# EasyEDA schematic SCH_hack-and-roll_2024-03-14.json
TITLE: Hack & Roll!; REV: 1.0; Date: 2024-02-08; Sheet: 1/1; Drawn By: Prophet Orpheus; Company: Orph inc.
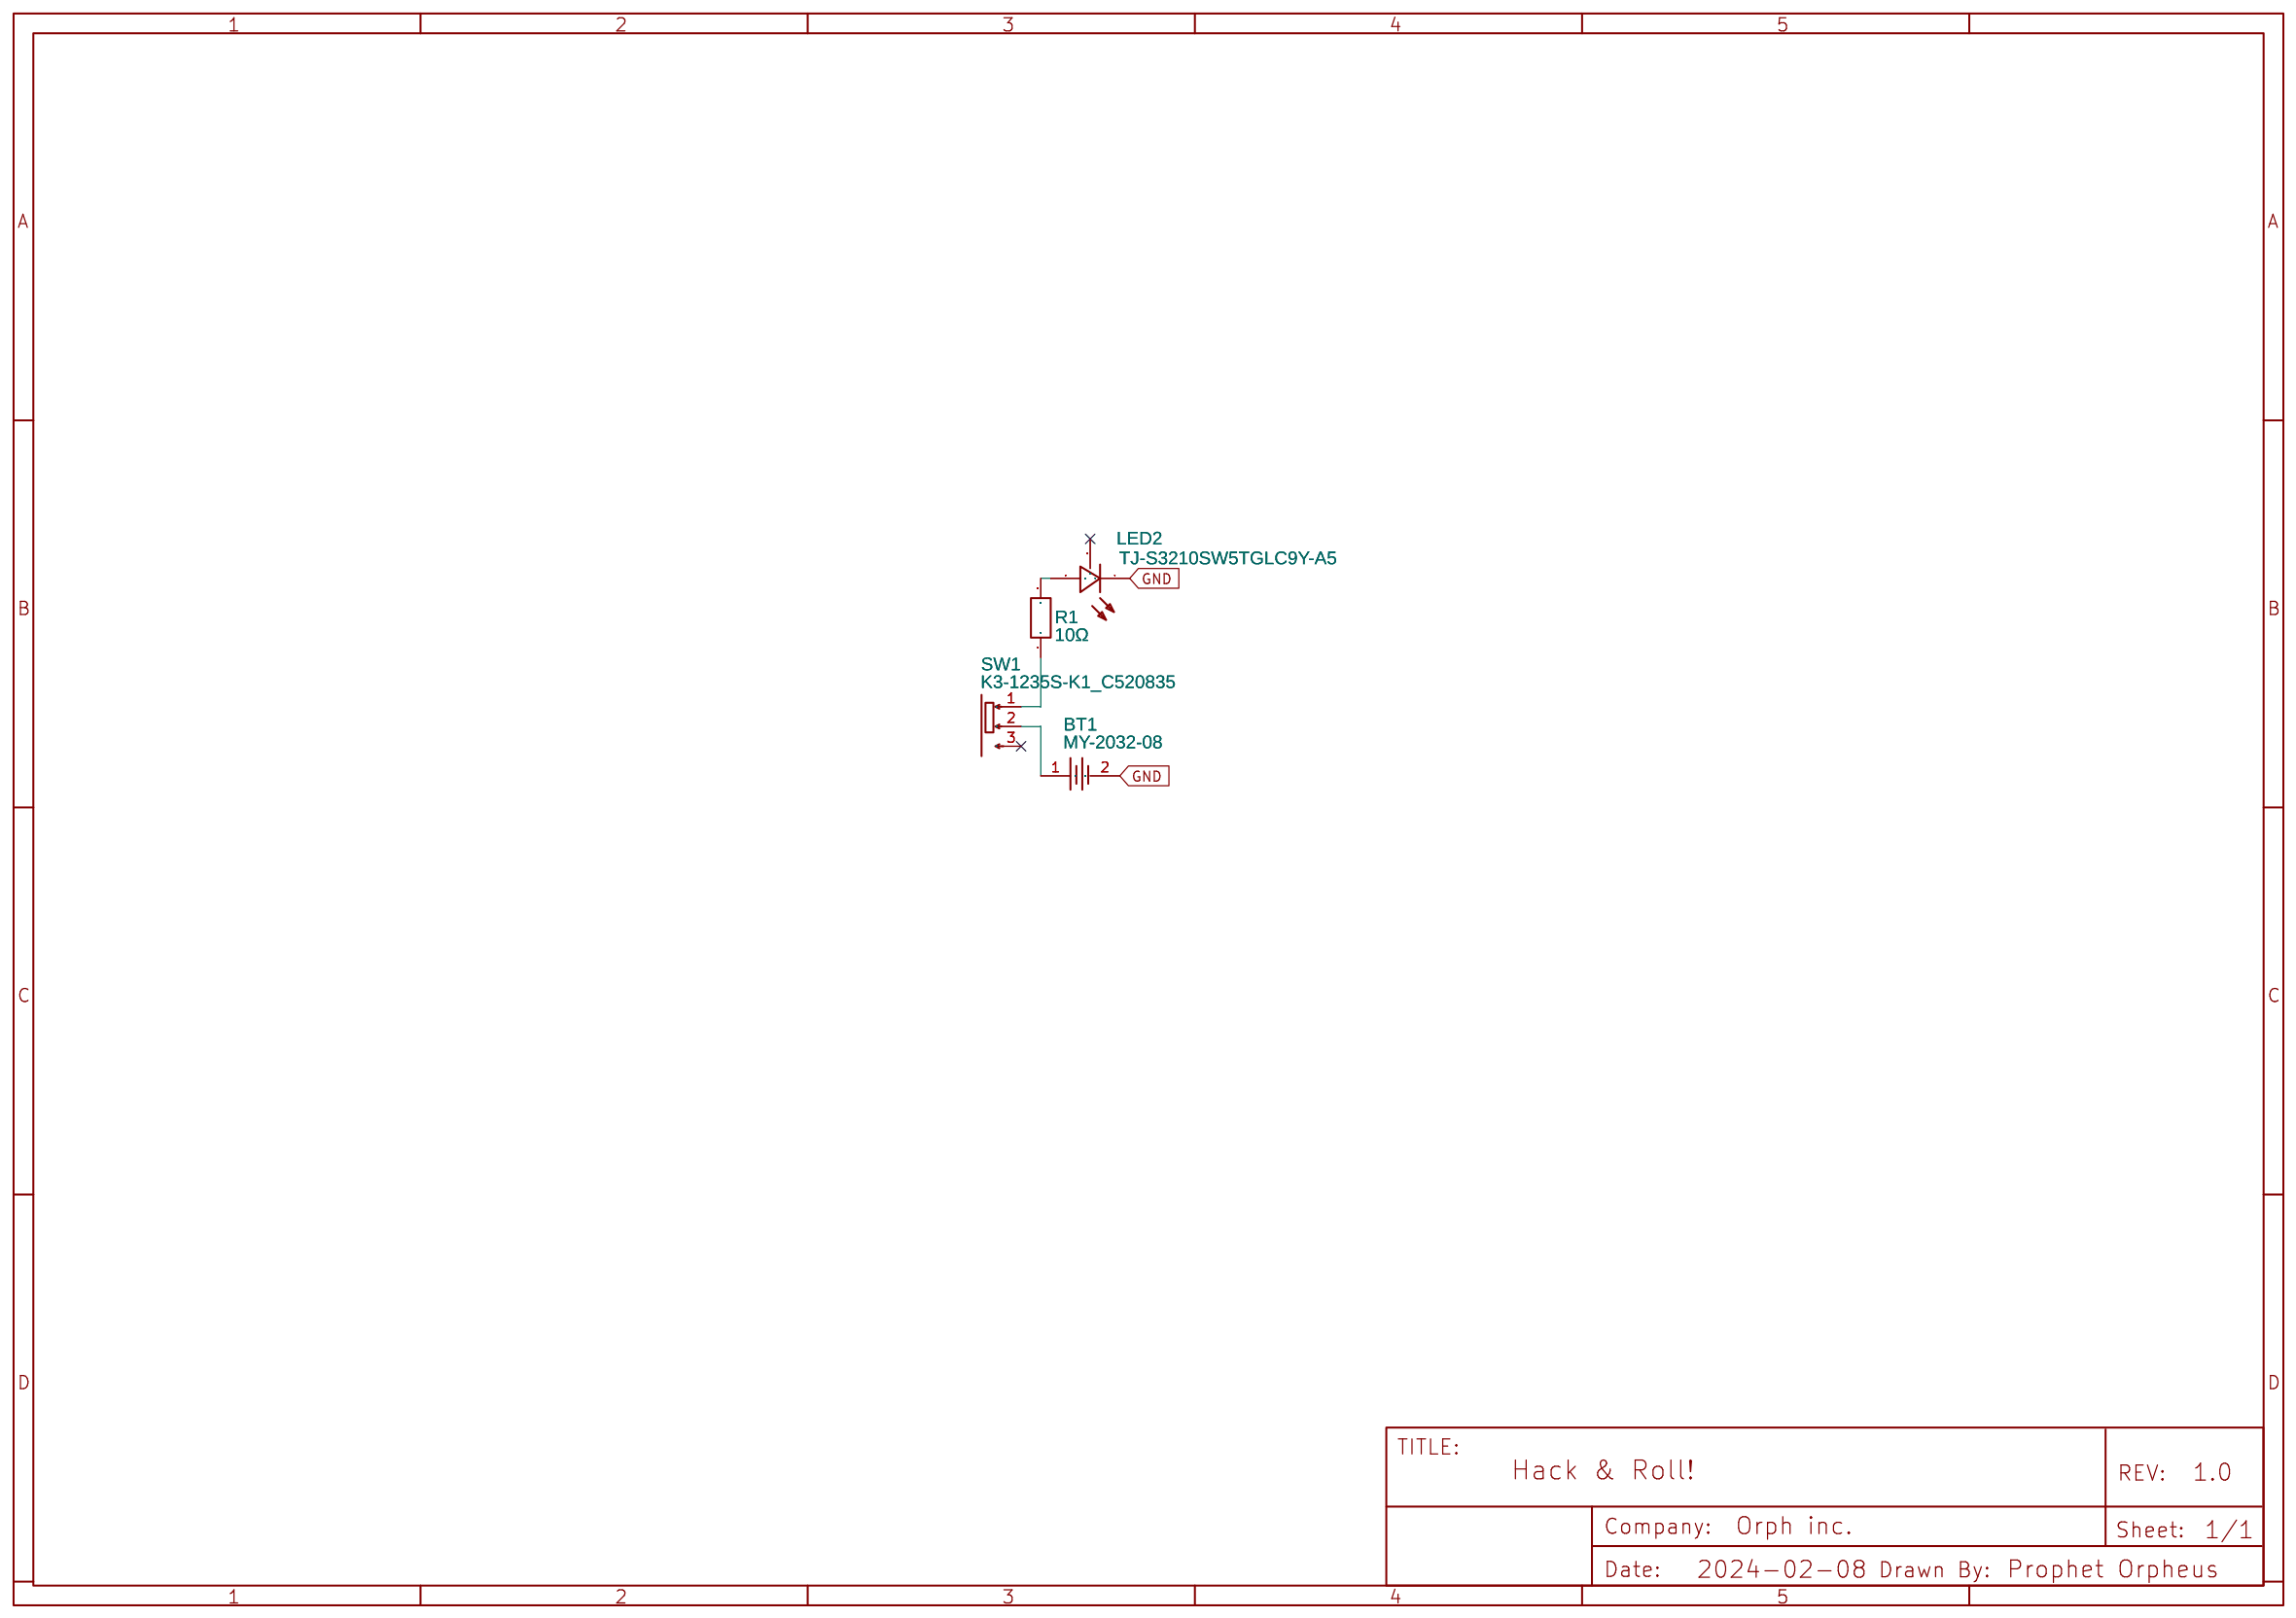
[diagram p0: schematic sheet]

## Parts
BT1  MY-2032-08  [BAT-SMD_MY-2032-08]
LED2  TJ-S3210SW5TGLC9Y-A5  [LED-SMD_3P-L3.2-W1.0-RD]
R1  10Ω  [R0603]
SW1  K3-1235S-K1_C520835  [SW-SMD_K3-1235S-K1_C520835]

## Library data of the parts
BT1 = MY-2032-08: Contributor: LCSC; Supplier: LCSC; Supplier Part: C964831; Manufacturer: MYOUNG(美阳); JLCPCB Part Class: Extended Part
LED2 = TJ-S3210SW5TGLC9Y-A5: Contributor: LCSC; Supplier: LCSC; Supplier Part: C273628; Manufacturer: TOGIALED(统佳); JLCPCB Part Class: Extended Part
R1 = R_0603_EU: Supplier Part: C22859; Supplier: LCSC; Contributor: LCEDA_Lib; Package Display: No
SW1 = K3-1235S-K1_C520835: Contributor: LCSC; Supplier: LCSC; Supplier Part: C520835; Manufacturer: 韩国韩荣; Manufacturer Part: K3-1235S-K1; JLCPCB Part Class: Extended Part

## Nets
GND: BT1.2 LED2.1
Net-(BT1-1): BT1.1 SW1.2
Net-(LED2-2): LED2.2 R1.2
Net-(R1-1): R1.1 SW1.1

Not connected (* = marked no-connect by the designer): LED2 3*; SW1 3*
